# Altium schematic sheet sb-sonata-industriaal.SchDoc: RS485,RS232,Eth Connectors
size Letter; Organization: NewAE Technology Inc.; Address1: 1083 Queen St., Suite 196; Address2: Halifax; Address3: NS; Address4: Canada B3H 0B2; SheetNumber: 6; SheetTotal: 20; SheetApproved: YES
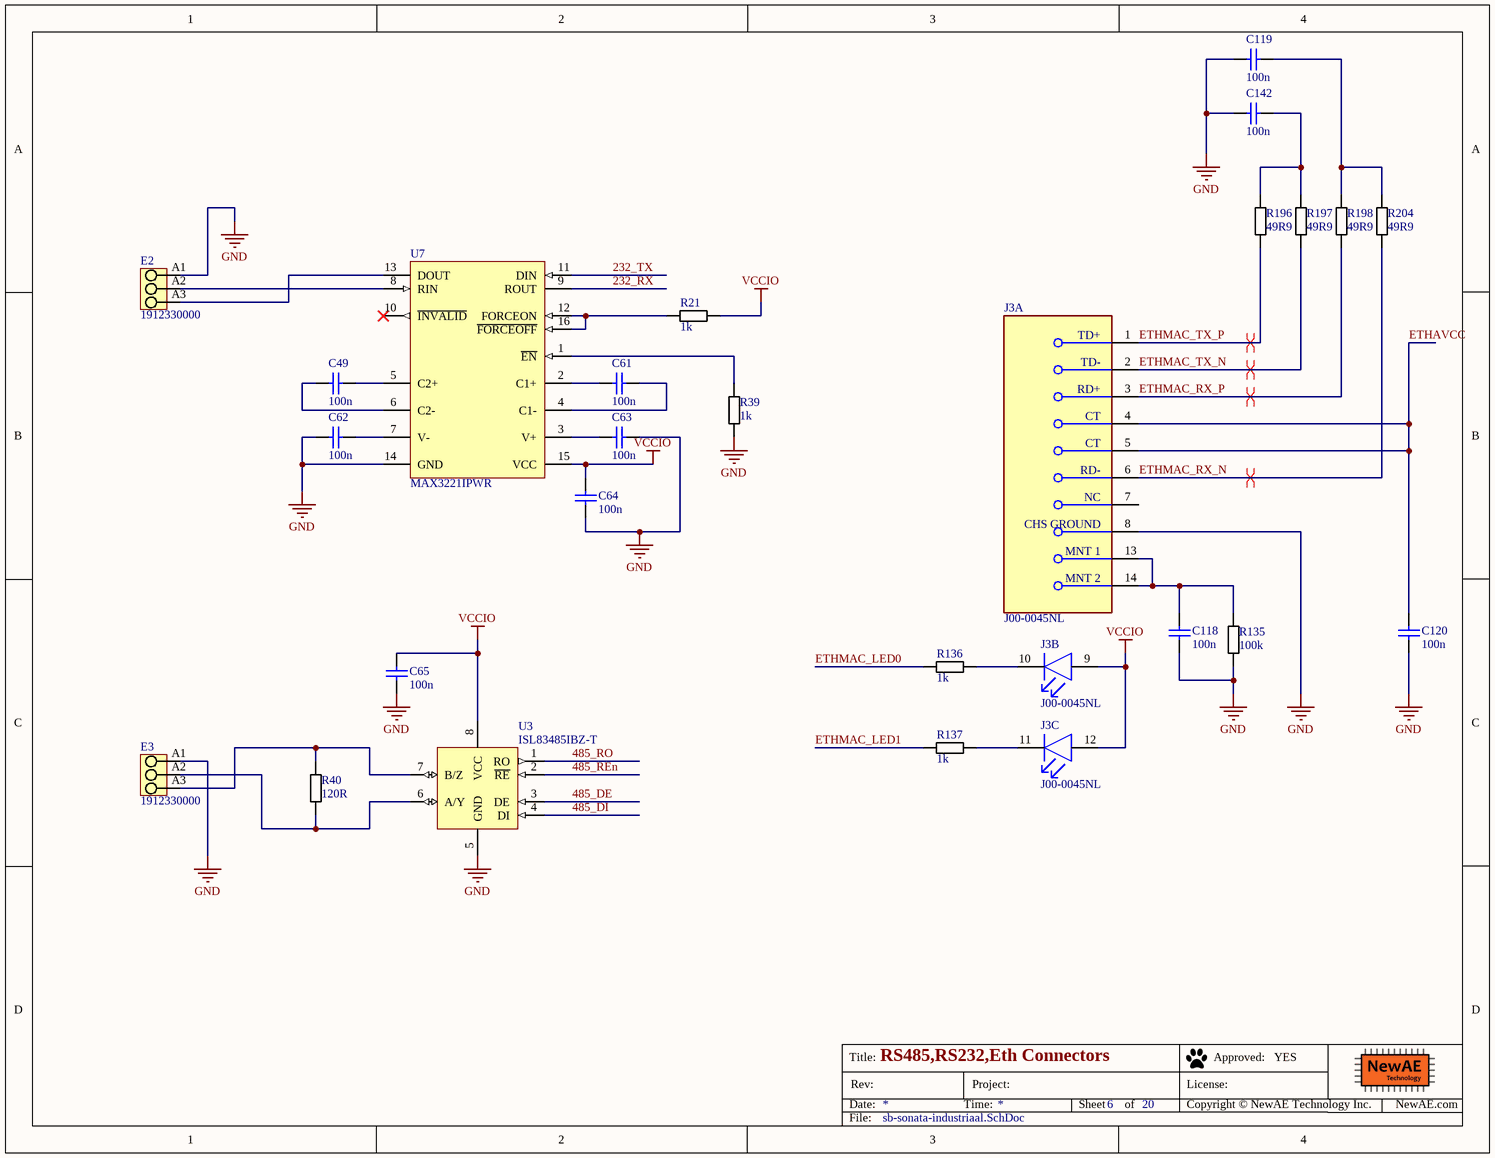
[diagram p0: sb-sonata-industriaal.SchDoc]

## Parts
C49  100n  [CAPC0402_M]
C61  100n  [CAPC0402_M]
C62  100n  [CAPC0402_M]
C63  100n  [CAPC0402_M]
C64  100n  [CAPC0402_M]
C65  100n  [CAPC0402_M]
C118  100n  [CAPC0402_M]
C119  100n  [CAPC0402_M]
C120  100n  [CAPC0402_M]
C142  100n  [CAPC0402_M]
E2  1912330000  [PS_3_5_90_03]
E3  1912330000  [PS_3_5_90_03]
J3  J00-0045NL  [FP-J00-0045NL-MFG]  (parts A,B,C of 3)
R21  1k  [RESC1608X55N]
R39  1k  [RESC1608X55N]
R40  120R  [RESC1608X55N]
R135  100k  [RESC1005X40N]
R136  1k  [RESC1608X55N]
R137  1k  [RESC1608X55N]
R196  49R9  [RESC2012X70N]
R197  49R9  [RESC2012X70N]
R198  49R9  [RESC2012X70N]
R204  49R9  [RESC2012X70N]
U3  ISL83485IBZ-T  [SOIC8_NARROW]
U7  MAX3221IPWR  [PW0016A_L]

## Nets
GND: C62.2 C63.1 C64.1 C65.2 C118.2 C119.1 C120.2 C142.1 E2.A1 E3.A1 J3.8(CHS_GROUND) R39.2 R135.2 U3.5(GND) U7.14(GND)
VCCIO: C64.2 C65.1 J3.9(GREEN_A) J3.12(YELLOW_ANODE) R21.2 U3.8(VCC) U7.15(VCC)
232_RX: U7.9(ROUT)
232_TX: U7.11(DIN)
485_DE: U3.3(DE)
485_DI: U3.4(DI)
485_REn: U3.2(~{RE})
485_RO: U3.1(RO)
ETHAVCC: C120.1 J3.4(CT) J3.5(CT)
ETHMAC_LED0: R136.1
ETHMAC_LED1: R137.1
ETHMAC_RX_N: J3.6(RD-) R204.2
ETHMAC_RX_P: J3.3(RD+) R198.2
ETHMAC_TX_N: J3.2(TD-) R197.2
ETHMAC_TX_P: J3.1(TD+) R196.2
NetC49_1: C49.1 U7.5(C2+)
NetC49_2: C49.2 U7.6(C2-)
NetC61_1: C61.1 U7.4(C1-)
NetC61_2: C61.2 U7.2(C1+)
NetC62_1: C62.1 U7.7(V-)
NetC63_2: C63.2 U7.3(V+)
NetC118_1: C118.1 J3.13(MNT_1) J3.14(MNT_2) R135.1
NetC119_2: C119.2 R198.1 R204.1
NetC142_2: C142.2 R196.1 R197.1
NetE2_A2: E2.A2 U7.8(RIN)
NetE2_A3: E2.A3 U7.13(DOUT)
NetE3_A2: E3.A2 R40.2 U3.6(A/Y)
NetE3_A3: E3.A3 R40.1 U3.7(B/Z)
NetJ3_10: J3.10(GREEN_C) R136.2
NetJ3_11: J3.11(YELLOW_CATHODE) R137.2
NetR21_1: R21.1 U7.12(FORCEON) U7.16(~{FORCEOFF})
NetR39_1: R39.1 U7.1(~{EN})

Not connected (* = marked no-connect by the designer): J3 7(NC); U7 10(~{INVALID})*

## Layout directives
differential pair; differential pair class ETHERNET: ETHMAC_RX_N, ETHMAC_RX_P, ETHMAC_TX_N, ETHMAC_TX_P

## Notes on the sheet
- Title:
- Date:
- Rev:
- Time:
- Project:
- Sheet
- of
- License:
- Copyright © NewAE Technology Inc.
- Approved:
- NewAE.com
- File:

## Library data of the parts
C49 C61-C65 C118-C120 C142 = CCHIP-100n-0402: 100n, 0402; Manufacture Part Number 1: CGA2B3X7R1V104K050BB; Component Group: Capacitor; Case-EIA: 0402; Part Number: CCHIP-100n-0402; Footprint: 0402; Pin Count: 2; Supplier 1: Digi-Key; Supplier Part Number 1: 445-6901-1-ND; Value: 100n; Mounting Technology: SMT; Component Kind: Standard; Component Type: Standard
E2 E3 = CMP-1559-01636-1: OMNIMATE Signal - series PS; Manufacturer: Weidmueller; No_of_poles: 3; Side_termination_characteristic: closed side; Pitch_inch: 0,138 inch; Short_text_for_material: PS 3.50/03/90 3.5SN OR BX; Wire_cross_section_AWG_max_UL_1059: AWG 16; Rated_voltage_use_group_B_UL_1059: 300 V; Solid_min_H05_07_V_U: 0,2 mm²; Contact_surface: tinned; UL_94_flammability_rating: V-0; Pitch_mm: 3,5 mm; Contact_material: Cu-Leg; Rated_current_use_group_B_UL_1059: 10 A; Solid_max_H05_07_V_U: 1,5 mm²; Mounting_onto_the_PCB: Solder connection; Rated_voltage_for_surge_voltage_class_pollution_degree_II_2: 320 V; Insulating_material: Wemid (PA); Wire_cross_section_AWG_min_UL_1059: AWG 28; Revision: V1; ComponentLink2Description: URL Link1; Packaging: Box; Qty: 100 PCS; ComponentLink2URL: http://catalog.weidmueller.com/catalog/Start.do?localeId=en&ObjectID=1912330000; PackageReference: PS_3_5_90_03; ComponentLink1Description: Manufacturer URL; ComponentLink1URL: http://www.weidmueller.com/; Solder_pin_length_mm: 3,5 mm; PartNumber: 1912330000; Colour: Orange
J3 = CMP-16436-000005-1: CONN JACK 1PORT 100 BASE-TX PCB; Number of Cores per Jack: 4; Gender: Female; Connector Type: RJ45; Number of Positions Loaded: 8; Current Rating: 8mA; Pitch: 2.54mm; Shielding: Shielded; Direction: Down; Number of Ports: 1; Depth: 21.59mm; Radiation Hardening: No; Contact Material: Bronze; Contact Plating: Gold; Mount: Through Hole; Max Operating Temperature: 70°C; Packaging: Rail/Tube; Color: Green; Number of Contacts: 8; Lead Free: Lead Free; Series: STARJACK™ J00; Package Quantity: 30; Length: 16.26mm; Number of Rows: 1; Min Operating Temperature: 0°C; Termination: Solder; Orientation: Right Angle; Housing Material: Thermoplastic
R21 R39 R136 R137 = RCHIP-1K-0603: 1k res, 0603, 1%, 1/10W; Manufacture 1: Yageo; Manufacture Part Number 1: RC0603FR-071KL; Component Group: Resistor; Case-EIA: 0603; Case-Metric: 1608; Rated Power: 0.1W; Rated Voltage: 75VDC; Part Number: RCHIP-1K-0603; Footprint: 0603; Pin Count: 2; Supplier 1: Digi-Key; Supplier Part Number 1: 311-1.00KHRCT-ND; Value: 1k; Tolerance: 1%; Mounting Technology: SMT; Temperature Range: -55C to 155C; Component Kind: Standard; Component Type: Standard
R40 = RCHIP-120R-0603: 120R res, 0603, 1%, 1/10W; Manufacture 1: Yageo; Manufacture Part Number 1: RC0603FR-07120RL; Component Group: Resistor; Case-EIA: 0603; Case-Metric: 1608; Rated Power: 0.1W; Rated Voltage: 75VDC; Part Number: RCHIP-120R-0603; Footprint: 0603; Pin Count: 2; Supplier 1: Digi-Key; Supplier Part Number 1: 311-120HRCT-ND; Value: 120R; Tolerance: 1%; Mounting Technology: SMT; Temperature Range: -55C to 155C; Component Kind: Standard; Component Type: Standard
R135 = RCHIP-100K-0402: 100k res, 0402, 1%, 1/16W; Manufacture 1: Yageo; Manufacture Part Number 1: RC0402FR-07100KL; Component Group: Resistor; Case-EIA: 0402; Case-Metric: 1005; Rated Power: 0.063W; Rated Voltage: 75VDC; Part Number: RCHIP-100K-0402; Footprint: 0402; Pin Count: 2; Supplier 1: Digi-Key; Supplier Part Number 1: 311-100KLRCT-ND; Value: 100k; Tolerance: 1%; Mounting Technology: SMT; Temperature Range: -55C to 155C; Component Kind: Standard; Component Type: Standard
R196-R198 R204 = RCHIP-49R9-0805: 49r9 res, 0805, 1%, 1/8W; Manufacture 1: Yageo; Manufacture Part Number 1: RC0805FR-0749R9L; Component Group: Resistor; Case-EIA: 0805; Case-Metric: 2012; Rated Power: 0.125W; Rated Voltage: 75VDC; Part Number: RCHIP-49R9-0805; Footprint: 0805; Pin Count: 2; Supplier 1: Digi-Key; Supplier Part Number 1: 311-49.9CRCT-ND; Value: 49R9; Tolerance: 1%; Mounting Technology: SMT; RoHS: Yes; Temperature Range: -55C to 155C; Component Kind: Standard; Component Type: Standard
U3 = ISL83485I: IC TXRX RS422/RS485; Manufacture 1: Renesas; Component Group: Digital IC; Part Number: ISL83485I; Footprint: SOIC8; Manufacture Part Number 1: ISL83485IBZ-T; Pin Count: 8; Supplier 1: Digi-Key; Supplier Part Number 1: ISL83485IBZ-TCT-ND; Mounting Technology: SMT; RoHS: Yes; Component Kind: Standard; Component Type: Standard
U7 = CMP-0299-01761-2: 3-V to 5.5-V Single-Channel RS-232 Line Driver / Receiver with ±15-kV ESD Protection, -40 to 85 degC, 16-Pin TSSOP (PW), Green (RoHS & no Sb/Br); Drivers Per Package: 1; ESD HBM(kV): +/-15; Supply Voltage(s)(V): 3.3 or 5.0; RS-232: TRUE; ComponentLink2Description: Datasheet; ComponentLink3URL: http://www.ti.com/litv/pdf/mpds361; SubFamily: RS-232; PackageDescription: 16-Pin Plastic Thin Small Outline Package 5 x 4.4 mm Body ,0.65 mm Pitch; ICC(Max)(mA): 1; PackageReference: PW0016A; Receivers Per Package: 1; DatasheetVersion: SLLS348M; PackageVersion: revG, Feb-2011; ComponentLink1URL: www.ti.com; ComponentLink1Description: Manufacturer URL; ComponentLink2URL: http://www.ti.com/general/docs/lit/getliterature.tsp?genericPartNumber=MAX3221&fileType=pdf; ComponentLink3Description: Package Specification; Single Supply: TRUE